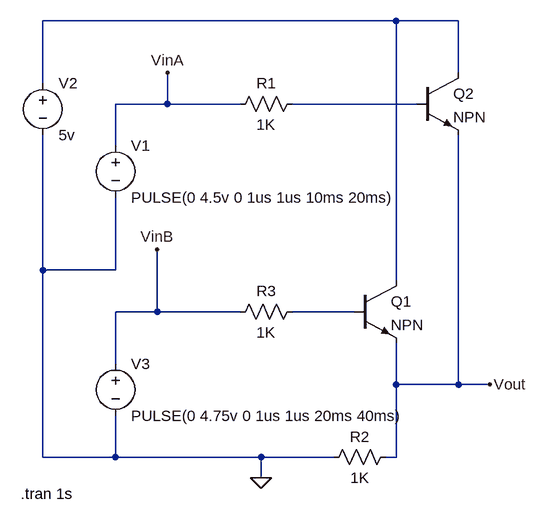
[diagram p0: schematic OR.asc]
OR.asc, the LTspice schematic file:
Version 4
SHEET 1 880 680
WIRE 464 -80 -80 -80
WIRE 560 -80 464 -80
WIRE 560 0 560 -80
WIRE -80 16 -80 -80
WIRE 112 48 112 0
WIRE 112 48 32 48
WIRE 224 48 112 48
WIRE 496 48 304 48
WIRE 32 112 32 48
WIRE -80 304 -80 96
WIRE 32 304 32 192
WIRE 32 304 -80 304
WIRE 464 320 464 -80
WIRE 96 368 96 272
WIRE 96 368 32 368
WIRE 224 368 96 368
WIRE 400 368 304 368
WIRE 32 448 32 368
WIRE 464 480 464 416
WIRE 560 480 560 96
WIRE 560 480 464 480
WIRE 608 480 560 480
WIRE -80 592 -80 304
WIRE 32 592 32 528
WIRE 32 592 -80 592
WIRE 256 592 32 592
WIRE 368 592 256 592
WIRE 464 592 464 480
WIRE 464 592 448 592
WIRE 256 624 256 592
FLAG 112 0 VinA
FLAG 96 272 VinB
FLAG 256 624 0
FLAG 608 480 Vout
SYMBOL voltage 32 96 R0
WINDOW 123 0 0 Left 0
WINDOW 39 0 0 Left 0
SYMATTR InstName V1
SYMATTR Value PULSE(0 4.5v 0 1us 1us 10ms 20ms)
SYMBOL res 320 32 R90
WINDOW 0 0 56 VBottom 2
WINDOW 3 32 56 VTop 2
SYMATTR InstName R1
SYMATTR Value 1K
SYMBOL voltage -80 0 R0
SYMATTR InstName V2
SYMATTR Value 5v
SYMBOL voltage 32 432 R0
WINDOW 123 0 0 Left 0
WINDOW 39 0 0 Left 0
SYMATTR InstName V3
SYMATTR Value PULSE(0 4.75v 0 1us 1us 20ms 40ms)
SYMBOL res 320 352 R90
WINDOW 0 0 56 VBottom 2
WINDOW 3 32 56 VTop 2
SYMATTR InstName R3
SYMATTR Value 1K
SYMBOL npn 400 320 R0
SYMATTR InstName Q1
SYMBOL npn 496 0 R0
SYMATTR InstName Q2
SYMBOL res 464 576 R90
WINDOW 0 0 56 VBottom 2
WINDOW 3 32 56 VTop 2
SYMATTR InstName R2
SYMATTR Value 1K
TEXT -114 648 Left 2 !.tran 1s

The netlist it stands for:
* OR.asc
V1 VinA 0 PULSE(0 4.5v 0 1us 1us 10ms 20ms)
R1 N002 VinA 1K
V2 N001 0 5v
V3 VinB 0 PULSE(0 4.75v 0 1us 1us 20ms 40ms)
R3 N003 VinB 1K
Q1 N001 N003 Vout 0 NPN
Q2 N001 N002 Vout 0 NPN
R2 Vout 0 1K
.model NPN NPN
.model PNP PNP
.lib standard.bjt
.tran 1s
.backanno
.end

* Results of the author's LTspice run, read from the files saved beside the schematic
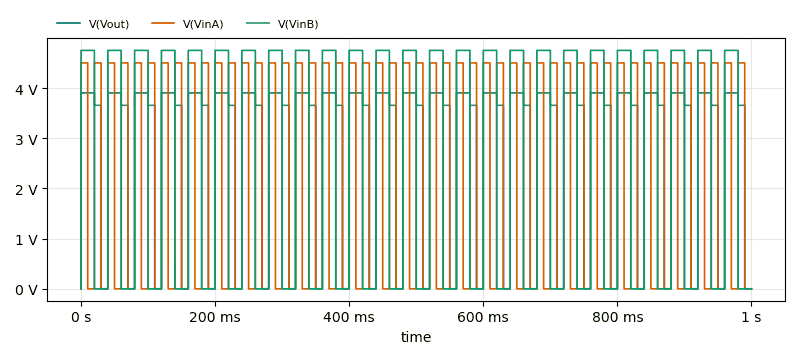
[diagram p1: Transient Analysis of OR.asc, plotted from the saved traces]
* Transient Analysis, 1 run:
*   V(Vout): min 0 V, max 3.902 V, average 2.865 V, rms 3.31 V, last 0 V
*   V(VinA): min 0 V, max 4.5 V, average 2.25 V, rms 3.182 V, last 0 V
*   V(VinB): min 0 V, max 4.75 V, average 2.375 V, rms 3.359 V, last 0 V